# EAGLE design Nanotouch1v0 (EAGLE 5.06)
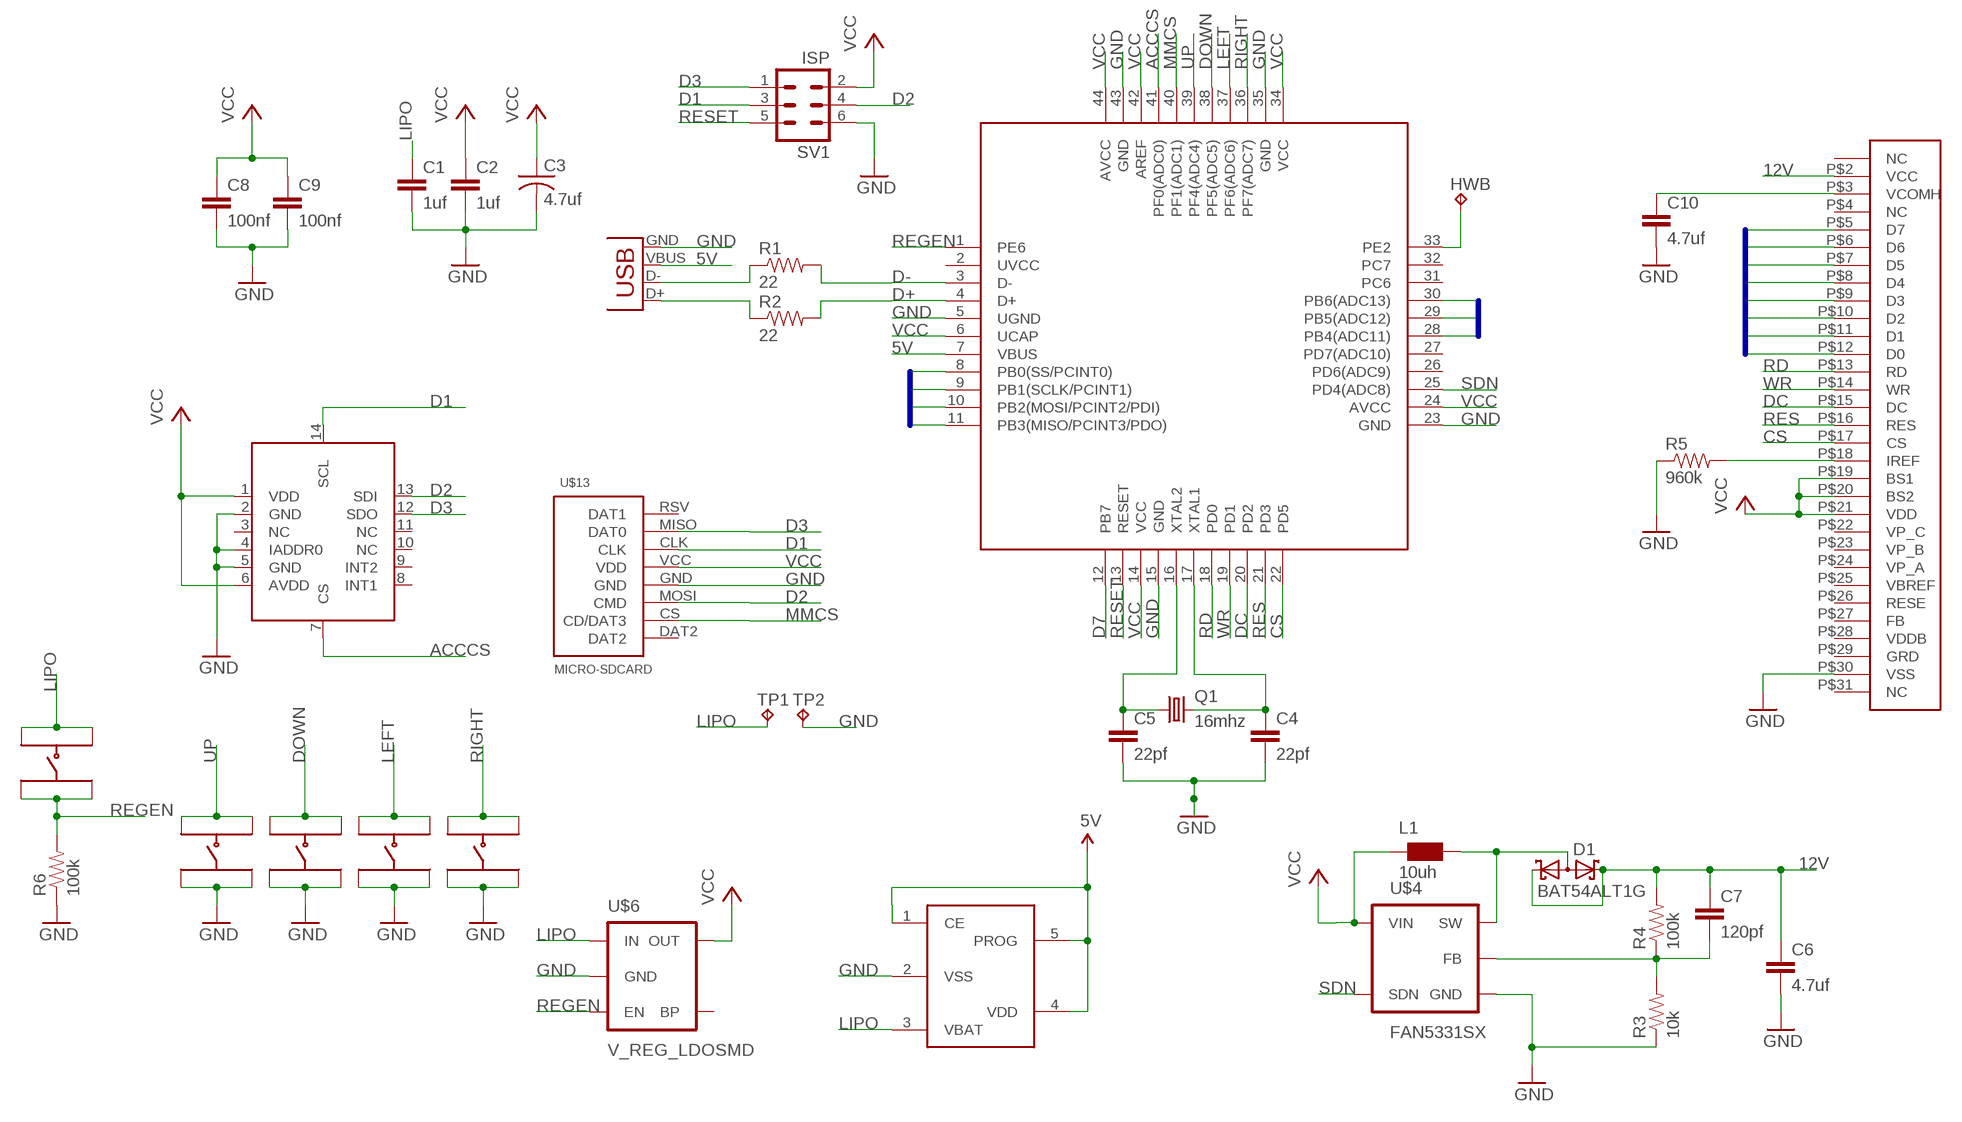
[diagram p0: schematic, sheet 1]

## Parts
C1  1uf  CAP0805  [0805]
C2  1uf  CAP0805  [0805]
C3  4.7uf  C-USC1206  [C1206]
C4  22pf  CAP0805  [0805]
C5  22pf  CAP0805  [0805]
C6  4.7uf  CAP0805  [0805]
C7  120pf  CAP0805  [0805]
C8  100nf  CAP0805  [0805]
C9  100nf  CAP0805  [0805]
C10  4.7uf  CAP0805  [0805]
D1  BAT54ALT1G  [SOT23]
HWB  TPTP10R  [TP10R]
L1  10uh  WE-KIHQ_1008  [WE-KI_1008_B]
Q1  16mhz  CRYSTAL5X3  [CRYSTAL-SMD-5X3]
R1  22  RESISTOR  [0805]
R2  22  RESISTOR  [0805]
R3  10k  RESISTOR  [0805]
R4  100k  RESISTOR  [0805]
R5  960k  RESISTOR  [0805]
R6  100k  RESISTOR  [0805]
SV1  ISP  MA03-2  [MA03-2]
TP1  TPTP10R  [TP10R]
TP2  TPTP10R  [TP10R]
U$1  ATMEGA32U4  [QFN44]
U$2  OLED104  [OLED104]
U$3  TACTSWITCH  [TACTSWITCH]
U$4  FAN5331SX  [SOT23-5]
U$5  MCP73811  [SOT23-5]
U$6  V_REG_LDOSMD  [SOT23-5]
U$7  MMA7455  [LGA]
U$9  TACTSWITCH  [TACTSWITCH]
U$10  TACTSWITCH  [TACTSWITCH]
U$11  TACTSWITCH  [TACTSWITCH]
U$12  TACTSWITCH  [TACTSWITCH]
U$13  MICRO-SDCARD  [MICRO-SDCARD]
X1  USBSMD  [USB-MINIB]

## Nets
5V [power]: U$1.7(VBUS) U$5.1(CE) U$5.4(VDD) U$5.5(PROG) X1.VBUS
12V: C6.1 C7.1 D1.1(K1) D1.2(K2) R4.2 U$2.P$2(VCC)
ACCCS: U$1.41(PF0(ADC0)) U$7.7(CS)
CS: U$1.22(PD5) U$2.P$17(CS)
D0: U$1.8(PB0(SS/PCINT0)) U$2.P$12(D0)
D1: SV1.3 U$1.9(PB1(SCLK/PCINT1)) U$2.P$11(D1) U$7.14(SCL) U$13.CLK
D2: SV1.4 U$1.10(PB2(MOSI/PCINT2/PDI)) U$2.P$10(D2) U$7.13(SDI) U$13.MOSI(CMD)
D3: SV1.1 U$1.11(PB3(MISO/PCINT3/PDO)) U$2.P$9(D3) U$7.12(SDO) U$13.MISO(DAT0)
D4: U$1.28(PB4(ADC11)) U$2.P$8(D4)
D5: U$1.29(PB5(ADC12)) U$2.P$7(D5)
D6: U$1.30(PB6(ADC13)) U$2.P$6(D6)
D7: U$1.12(PB7) U$2.P$5(D7)
D+: R2.2 U$1.4(D+)
D-: R1.2 U$1.3(D-)
DC: U$1.20(PD2) U$2.P$15(DC)
DOWN: U$1.38(PF5(ADC5)) U$9.1 U$9.4
GND [power]: C1.2 C2.2 C3.2 C4.2 C5.2 C6.2 C8.2 C9.2 C10.2 R3.1 R5.1 R6.1 SV1.6 TP2.TP U$1.5(UGND) U$1.15(GND) U$1.23(GND) U$1.35(GND) U$1.43(GND) U$2.P$30(VSS) U$3.2 U$3.3 U$4.2(GND) U$5.2(VSS) U$6.2(GND) U$7.2(GND) U$7.4(IADDR0) U$7.5(GND) U$9.2 U$9.3 U$10.2 U$10.3 U$11.2 U$11.3 U$13.GND X1.GND
LEFT: U$1.37(PF6(ADC6)) U$10.1 U$10.4
LIPO [power]: C1.1 TP1.TP U$5.3(VBAT) U$6.1(IN) U$12.1 U$12.4
MMCS: U$1.40(PF1(ADC1)) U$13.CS(CD/DAT3)
N$1: R1.1 X1.D-
N$2: R2.1 X1.D+
N$3: C4.1 Q1.3 U$1.17(XTAL1)
N$4: D1.3(AA) L1.1 U$4.1(SW)
N$5: C7.2 R3.2 R4.1 U$4.3(FB)
N$6: C5.1 Q1.1 U$1.16(XTAL2)
N$7: HWB.TP U$1.33(PE2)
N$8: R5.2 U$2.P$18(IREF)
N$9: C10.1 U$2.P$3(VCOMH)
RD: U$1.18(PD0) U$2.P$13(RD)
REGEN: R6.2 U$1.1(PE6) U$6.3(EN) U$12.2 U$12.3
RES: U$1.21(PD3) U$2.P$16(RES)
RESET: SV1.5 U$1.13(RESET)
RIGHT: U$1.36(PF7(ADC7)) U$11.1 U$11.4
SDN: U$1.25(PD4(ADC8)) U$4.5(SDN)
UP: U$1.39(PF4(ADC4)) U$3.1 U$3.4
VCC [power]: C2.1 C3.1 C8.1 C9.1 L1.2 SV1.2 U$1.6(UCAP) U$1.14(VCC) U$1.24(AVCC) U$1.34(VCC) U$1.42(AREF) U$1.44(AVCC) U$2.P$19(BS1) U$2.P$20(BS2) U$2.P$21(VDD) U$4.4(VIN) U$6.5(OUT) U$7.1(VDD) U$7.6(AVDD) U$13.VCC(VDD)
WR: U$1.19(PD1) U$2.P$14(WR)
Unconnected: U$1.2(UVCC) U$1.26(PD6(ADC9)) U$1.27(PD7(ADC10)) U$1.31(PC6) U$1.32(PC7) U$2.P$1(NC) U$2.P$4(NC) U$2.P$22(VP_C) U$2.P$23(VP_B) U$2.P$24(VP_A) U$2.P$25(VBREF) U$2.P$26(RESE) U$2.P$27(FB) U$2.P$28(VDDB) U$2.P$29(GRD) U$2.P$31(NC) U$6.4(BP) U$7.3(NC) U$7.8(INT1) U$7.9(INT2) U$7.10(NC) U$7.11(NC) U$13.DAT2 U$13.RSV(DAT1)

## Buses
D[0..7]

## Library data of the parts
C1 C2 C4-C10 = SparkFun:CAP: Capacitor Standard 0603 ceramic capacitor, and 0.1" leaded capacitor.
C3 = resistor:C-US: CAPACITOR, American symbol
D1 = PeterAtMega644:BAT54ALT1G: Schottky Dual Common Anode
HWB TP1 TP2 = testpad:TP: Test pad
L1 = PeterAtMega644:WE-KIHQ: SMD Wire Wound Ceramic Inductor WE-KIHQ - High current - Highest Quality factor in size 0805 - up to 98 - High thermal stability - High SRF -- Bluetooth -- Wireless LAN -- RF oscillation circuit -- IF impedance matching -- IG choke
Q1 = SparkFun:CRYSTAL: Crystals Various standard crystals. Proven footprints. Spark Fun Electronics SKU : COM-00534
R1-R6 = SparkFun:RESISTOR: Resistor Basic schematic elements and footprints for 0603, 1206, and PTH 1/10th watt (small) resistors.
SV1 = con-lstb:MA03-2: PIN HEADER
U$1 = PeterAtMega644:ATMEGA32U4
U$2 = PeterAtMega644:OLED104: LG 1.04 Inch OLED
U$3 U$9-U$12 = PeterAtMega644:TACTSWITCH
U$4 = PeterAtMega644:FAN5331SX: OLED Supply with 20V Integrated Switch
U$5 = PeterAtMega644:MCP73811
U$6 = PeterAtMega644:V_REG_LDO: Voltage Regulator LDO Standard 150mA LDO voltage regulator in SOT-23 layout. Micrel part MIC5205. BP (by-pass) pin is used to lower output noise with 470pF cap.
U$7 = PeterAtMega644:MMA7455
U$13 = SparkFun:MICRO-SDCARD
X1 = PeterAtMega644:USB: USB Connectors USB-B-PTH is fully proven SKU : PRT-00139 USB-miniB is fully proven SKU : PRT-00587 USB-A-PCB is untested. USB-A-H is throughly reviewed, but untested. Spark Fun Electronics SKU : PRT-00437 USB-B-SMT is throughly reviewed, but untested. Needs silkscreen touching up. USB-A-S has not been used/tested USB-MB-H has not been used/tested

## Net classes
0 default: width 0.152 mm, drill 0.406 mm, clearance 0.152 mm
1 power: width 0.152 mm, drill 0.406 mm, clearance 0.152 mm

## Board
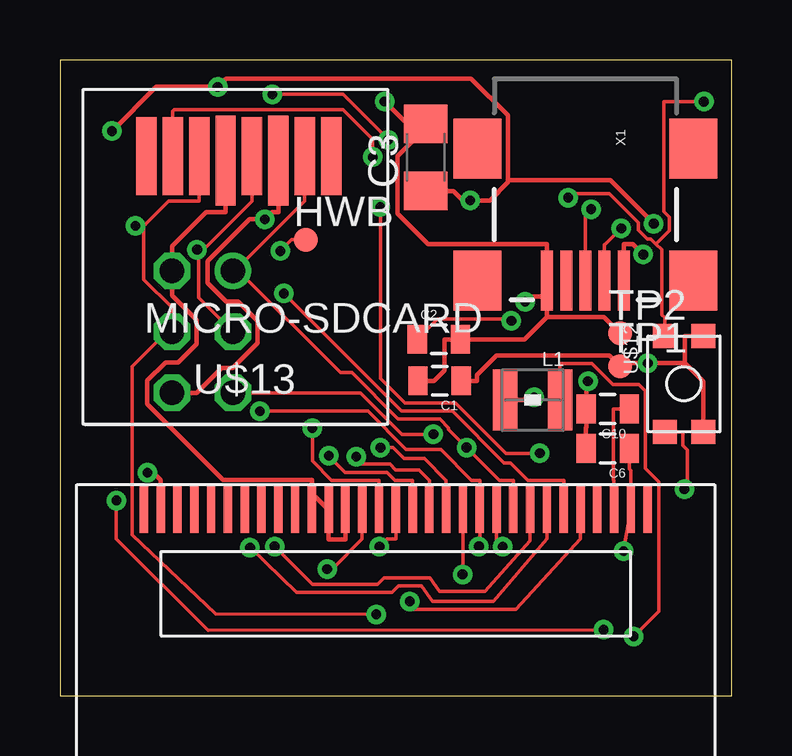
[diagram p1: board, top side]
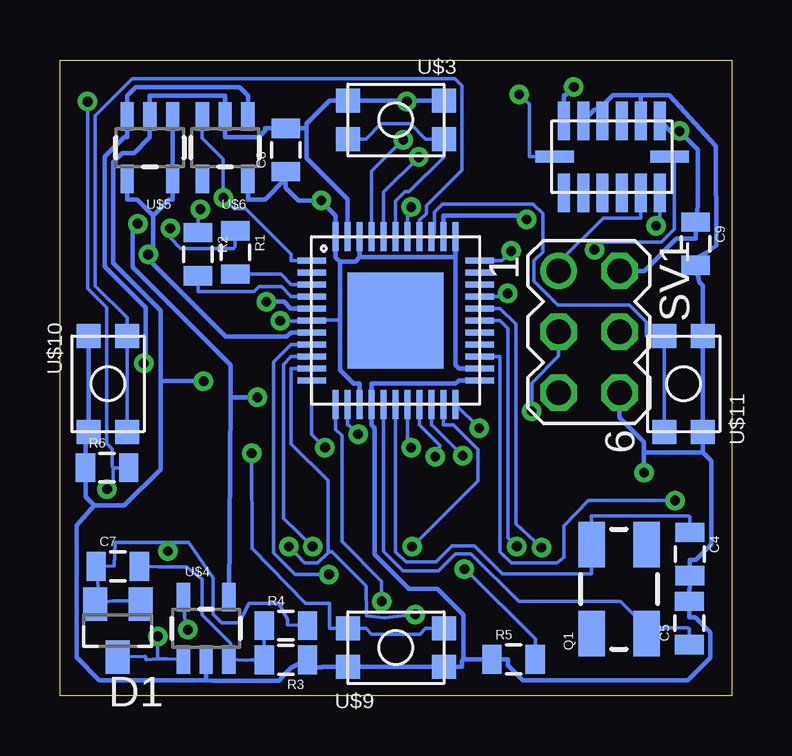
[diagram p2: board, bottom side, seen from below]

Size 28 x 26.5 mm. Coordinates in mm from the lower left corner, seen from the top.
Outline: 0,0 28,0 28,26.5 0,26.5 0,0
Copper layers (1*16): Top 0.0178mm / dielectric 1.4986mm / Bottom 0.0178mm
Design rules "SSC-EAGLE-2Lyr_v1.0.0.3": minimum track width 6mil, minimum drill 14mil, track to track 6mil, track to pad 6mil, pad to pad 6mil, via to via 6mil, smd to smd 6mil, copper to edge 20mil, drill to drill 16mil, minimum pad ring 8mil, minimum via ring 8mil, stop-mask expansion 3mil, vias tented up to drill 0mil, thermal gap 10mil

### Footprints (pad centres in the part's own frame; a part is rotated, then mirrored left to right if it is on the bottom)
0805 = smd 0.8 x 1.2: 1 -0.9,0; 2 0.9,0
C1206 = smd 1.6 x 1.8: 1 -1.4,0; 2 1.4,0
SOT23 = smd 1 x 1.4: 1 -0.95,-1.1; 2 0.95,-1.1; 3 0,1.1
TP10R = smd 1 x 1: TP 0,0
WE-KI_1008_B = smd 1.02 x 2.54: 1 -1.145,0; 2 1.145,0
CRYSTAL-SMD-5X3 = smd 1.9 x 1.1: 1 -1.85,-1.15; 2 1.85,-1.15; 3 1.85,1.15; 4 -1.85,1.15
MA03-2 = drill 1.016 round: 1 -2.54,-1.27 | drill 1.016 octagon: 2 -2.54,1.27; 3 0,-1.27; 4 0,1.27; 5 2.54,-1.27; 6 2.54,1.27
QFN44 = smd 1.2 x 0.25: 1 -3.5,2.5; 2 -3.5,2; 3 -3.5,1.5; 4 -3.5,1; 5 -3.5,0.5; 6 -3.5,0; 7 -3.5,-0.5; 8 -3.5,-1; 9 -3.5,-1.5; 10 -3.5,-2; 11 -3.5,-2.5; 23 3.5,-2.5; 24 3.5,-2; 25 3.5,-1.5; 26 3.5,-1; 27 3.5,-0.5; 28 3.5,0; 29 3.5,0.5; 30 3.5,1; 31 3.5,1.5; 32 3.5,2; 33 3.5,2.5 | smd 0.25 x 1.2: 12 -2.5,-3.5; 13 -2,-3.5; 14 -1.5,-3.5; 15 -1,-3.5; 16 -0.5,-3.5; 17 0,-3.5; 18 0.5,-3.5; 19 1,-3.5; 20 1.5,-3.5; 21 2,-3.5; 22 2.5,-3.5; 34 2.5,3.5; 35 2,3.5; 36 1.5,3.5; 37 1,3.5; 38 0.5,3.5; 39 0,3.5; 40 -0.5,3.5; 41 -1,3.5; 42 -1.5,3.5; 43 -2,3.5; 44 -2.5,3.5 | smd 4 x 4: P$45 0,0
OLED104 = smd 1.95 x 0.35: P$1 0,10.5; P$2 0,9.8; P$3 0,9.1; P$4 0,8.4; P$5 0,7.7; P$6 0,7; P$7 0,6.3; P$8 0,5.6; P$9 0,4.9; P$10 0,4.2; P$11 0,3.5; P$12 0,2.8; P$13 0,2.1; P$14 0,1.4; P$15 0,0.7; P$16 0,0; P$17 0,-0.7; P$18 0,-1.4; P$19 0,-2.1; P$20 0,-2.8; P$21 0,-3.5; P$22 0,-4.2; P$23 0,-4.9; P$24 0,-5.6; P$25 0,-6.3; P$26 0,-7; P$27 0,-7.7; P$28 0,-8.4; P$29 0,-9.1; P$30 0,-9.8; P$31 0,-10.5
TACTSWITCH = smd 1 x 1: 1 2,0.8; 2 2,-0.8; 3 -2,-0.8; 4 -2,0.8
SOT23-5 = smd 0.55 x 1.2: 1 -0.95,-1.3; 2 0,-1.3; 3 0.95,-1.3; 4 0.95,1.3; 5 -0.95,1.3
LGA = smd 1.6 x 0.5: 1 -1.5,2; 2 -1.5,1.2; 3 -1.5,0.4; 4 -1.5,-0.4; 5 -1.5,-1.2; 6 -1.5,-2; 8 1.5,-2; 9 1.5,-1.2; 10 1.5,-0.4; 11 1.5,0.4; 12 1.5,1.2; 13 1.5,2 | smd 0.5 x 1.6: 7 0,-2.4; 14 0,2.4
MICRO-SDCARD = smd 0.85 x 3.25: CLK 4.5,2.3; CS 1.2,2.3; DAT2 0.1,2.3; MISO 6.7,2.3; MOSI 2.3,2.3; RSV 7.8,2.3 | smd 0.85 x 3.75: GND 5.6,2.1; VCC 3.4,2.1
USB-MINIB = smd 2.5 x 0.5: D+ 2.5,0; D- 2.5,0.8; GND 2.5,-1.6; ID 2.5,-0.8; VBUS 2.5,1.6 | smd 2.5 x 2: GND@1 -3,-4.5; GND@2 -3,4.5; GND@3 2.5,4.5; GND@4 2.5,-4.5

### Placement (x,y rotation side)
C1  15.83,13.12 180 top
C2  15.79,14.85 0 top
C3  15.25,22.43 90 top
C4  1.74,5.9 270 bottom
C5  1.76,3.02 90 bottom
C6  22.84,10.3 180 top
C7  25.58,5.39 0 bottom
C8  18.59,22.75 90 bottom
C9  1.5,18.83 270 bottom
C10  22.84,11.94 180 top
D1  25.59,2.7 180 bottom
HWB  10.24,19 0 top
L1  19.7,12.32 180 top
Q1  4.69,4.43 90 bottom
R1  20.69,18.47 270 bottom
R2  22.25,18.4 270 bottom
R3  18.58,1.49 180 bottom
R4  18.58,2.92 0 bottom
R5  9.09,1.5 0 bottom
R6  26.04,9.5 0 bottom
SV1  5.94,15.16 270 bottom
TP1  23.35,13.73 0 top
TP2  23.35,15.1 0 top
U$1  14,15.64 0 bottom
U$2  14,7.75 270 top
U$3  14,24 180 bottom
U$4  21.91,2.8 0 bottom
U$5  24.25,22.84 180 bottom
U$6  21.11,22.85 180 bottom
U$7  4.98,22.46 270 bottom
U$9  14,2 0 bottom
U$10  26,13 270 bottom
U$11  2,13 90 bottom
U$12  26.01,13 270 top
U$13  3.51,20.19 0 top
X1  21.91,19.8 270 top

### Tracks (layer width: path | path; a pad name or v marks a point on that pad's centre or on a via)
5V  (via drill 0.41 pad 0.76)
  Top 0.178: v24.32,18.39 23.89,18.82 23.51,18.82 X1.VBUS
  Bottom 0.178: 24.11,20.01 24.11,18.56 24.28,18.39 | 24.11,20.01 24.78,20.68 25.2,20.68 U$5.4 | 24.11,20.01 23.44,20.68 23.3,20.68 U$5.5 U$5.1 | 24.28,18.39 24.28,18.15 21.09,14.96 18.55,14.96 18.37,15.14 U$1.7 | 24.28,18.39 v24.32,18.39
12V  (via drill 0.41 pad 0.76)
  Top 0.152: v23.5,6.02 U$2.P$2 23.8,9.38 23.74,9.45 C6.1
  Bottom 0.152: R4.2 18.51,2.94 18.51,3.19 18.89,3.85 20.11,3.85 20.52,3.03 21.26,3.03 21.61,3.38 21.61,4.9 22.63,6.38 23.34,6.38 | 23.34,6.38 25.7,6.38 25.73,5.41 26.39,5.39 C7.1 26.38,4.31 26.48,3.87 | 23.34,6.38 v23.5,6.02 | 26.48,3.87 D1.2 | 26.48,3.87 25.79,3.94 24.73,3.96 D1.1
ACCCS  (via drill 0.41 pad 0.76)
  Top 0.152: v8.85,25.07 11.8,25.07 v13.69,23.18
  Bottom 0.152: U$1.41 15,21.87 v13.69,23.18 | U$7.7 8.44,22.46 8.44,24.65 v8.85,25.07
CS  (via drill 0.41 pad 0.76)
  Top 0.152: U$2.P$17 13.3,8.98 11.33,8.98 10.53,9.78 v10.53,11.15
  Bottom 0.152: U$1.22 10.53,11.17 v10.53,11.15
D0  (via drill 0.41 pad 0.76)
  Top 0.152: v16.78,5.05 16.8,5.22 16.8,6.52 U$2.P$12
  Bottom 0.152: v16.78,5.05 18.2,5.05 19.09,5.95 19.09,13.9 18.35,14.64 U$1.8
D1  (via drill 0.41 pad 0.76)
  Top 0.152: v8.33,11.86 12.84,11.86 14.43,10.26 15.88,10.26 17.16,8.98 17.5,8.98 U$2.P$11 17.5,6.52 17.5,6.23 v17.47,6.21 | 5.85,18.46 v5.72,18.59 | 5.85,18.46 5.78,18.38 5.78,16.6 SV1.3 | 5.85,18.46 8.01,20.61 U$13.CLK
  Bottom 0.152: v8.33,11.86 8.33,13.03 7.21,14.15 SV1.3 | v17.47,6.21 18.68,7.38 18.68,13.81 18.35,14.14 U$1.9 | U$7.14 2.39,22.27 2.39,19.44 2.93,18.9 5.4,18.9 v5.72,18.59
D2  (via drill 0.41 pad 0.76)
  Top 0.152: v13.19,3.38 6.48,3.41 3.01,6.71 3.01,13.71 4.67,15.38 | 4.67,15.38 4.67,15.59 4.67,15.67 4.67,16.18 3.5,17.35 3.5,19.58 | 4.67,15.38 SV1.4 | v18.46,6.21 18.2,6.47 18.2,6.52 U$2.P$10 | 3.5,19.58 4.53,20.61 5.8,20.61 U$13.MOSI | 3.5,19.58 v3.15,19.58
  Bottom 0.152: v13.19,3.38 14.47,3.23 15.22,3.32 15.24,4.57 16.68,6.01 16.82,5.96 | 16.82,5.96 16.82,8.96 18.35,10.49 18.35,13.64 U$1.10 | v18.46,6.21 17.8,5.53 17.25,5.53 16.82,5.96 | U$7.13 2.98,19.91 3.15,19.74 v3.15,19.58
D3  (via drill 0.41 pad 0.76)
  Top 0.152: 7.37,17.78 11.7,13.46 12.17,13.46 14.1,11.53 15.84,11.53 16.21,11.16 16.21,11.09 v16.95,10.34 18.32,8.98 18.9,8.98 U$2.P$9 | 7.37,17.78 10.21,20.61 U$13.MISO | SV1.1 7.29,17.7 7.37,17.78
  Bottom 0.152: U$1.11 17.5,10.89 v16.95,10.34 | SV1.1 7.21,18.05 5.35,19.91 3.78,19.91 U$7.12
D4  (via drill 0.41 pad 0.76)
  Top 0.152: U$2.P$8 19.6,6.46 17.71,4.33 15.83,4.33 15.43,4.92 13.52,4.92 13.24,4.63 10.53,4.63 v8.95,6.21
  Bottom 0.152: v8.95,6.21 9.32,6.58 9.32,15.31 9.65,15.64 U$1.28
D5  (via drill 0.41 pad 0.76)
  Top 0.152: v7.93,6.17 9.87,4.3 13.84,4.3 14.11,4.57 15.07,4.57 15.54,3.93 18.06,3.93 20.3,6.52 U$2.P$7
  Bottom 0.152: U$1.29 9.65,16.14 8.98,15.48 8.98,7.15 v7.93,6.17
D6  (via drill 0.41 pad 0.76)
  Top 0.152: v9.34,16.77 14.24,11.86 16.36,11.86 18.52,9.7 18.78,9.7 19.5,8.98 21,8.98 U$2.P$6
  Bottom 0.152: v9.34,16.77 9.52,16.77 9.65,16.64 U$1.30
D7  (via drill 0.41 pad 0.76)
  Top 0.152: v14.59,3.92 14.63,3.6 19.01,3.6 21.7,6.52 U$2.P$5
  Bottom 0.152: U$1.12 16.5,11.1 16.25,10.85 16.25,6.42 14.59,4.76 v14.59,3.92
D+
  Bottom 0.152: R2.2 22.25,16.85 19.91,16.85 19.7,17.05 18.77,17.05 18.35,16.64 U$1.4
D-
  Bottom 0.152: U$1.3 18.35,17.14 18.79,17.57 19.84,17.57 R1.2
DC  (via drill 0.41 pad 0.76)
  Top 0.152: v11.21,10 11.89,9.31 13.63,9.31 13.96,8.98 14.7,8.98 U$2.P$15
  Bottom 0.152: v11.21,10 12.49,11.29 12.5,11.29 U$1.20
DOWN  (via drill 0.41 pad 0.76)
  Top 0.152: v20.01,10.1 18.59,10.1 16.5,12.19 14.38,12.19 13.36,13.21 v13.36,20.37
  Bottom 0.152: U$9.1 12.75,2.8 12.99,2.56 15.01,2.56 15.25,2.8 U$9.4 16.38,2.8 16.75,2.8 16.75,3.23 16.75,3.83 17.75,3.83 19.98,6.14 v20.01,10.1 | v13.36,20.37 13.5,20.22 U$1.38
GND  (via drill 0.41 pad 0.76)
  Top 0.178: v3.65,9.29 3.9,9.29 4.2,8.99 U$2.P$30 | 14.95,23.36 14.08,22.48 14.08,20.09 15.35,18.82 20.31,18.82 X1.GND 20.31,16.63 | SV1.6 5.7,12.62 6.73,13.66 7.2,13.66 8.24,14.69 8.24,15.61 7.42,16.43 6.93,16.43 6.16,17.2 6.16,18.11 7.9,19.86 v8.54,19.86 8.84,20.15 9.11,20.15 U$13.GND | C1.2 15.6,13.12 16.03,13.55 16.03,14.85 C2.2 17.36,14.85 19.37,14.85 20.31,15.78 | 20.31,16.63 19.61,16.63 v19.39,16.42 | 20.31,16.63 20.31,15.78 | v22.01,13.11 22.01,12.89 21.94,12.81 C10.2 21.94,11.17 C6.2 | 14.95,23.36 15.25,23.65 C3.2 | v13.53,24.77 14.95,23.36 | TP2.TP 22.67,15.78 20.31,15.78
  Bottom 0.178: 17.72,23.65 17.72,22.41 16,20.7 U$1.43 | 17.72,23.65 17.81,23.65 C8.2 19.45,23.65 19.45,23.55 19.73,23.28 21.11,23.28 U$6.2 21.11,25.01 24.25,25.01 U$5.2 24.25,23.28 24.91,22.62 25.4,22.62 25.79,22.23 25.79,18.03 23.81,16.05 23.81,13.11 | 17.72,23.65 17.72,23.85 16.77,24.8 U$3.2 15.62,24.8 15.23,24.8 13.53,24.8 | 21.91,0.64 21.66,0.62 18.86,0.62 18.63,0.89 18.37,1.16 R3.1 17.58,1.19 17.51,1.19 17.41,1.19 17.08,1.19 17.06,1.2 16.77,1.2 16.38,1.2 U$9.3 15.23,1.2 12.77,1.2 12.38,1.2 U$9.2 11.23,1.2 11.23,1.46 11.19,1.5 | 26.58,7.92 25.32,7.92 23.81,9.44 23.81,13.11 | 26.58,7.92 26.93,8.28 26.93,8.63 R6.1 26.93,11.14 26.8,11.27 | 26.58,7.92 27.31,7.09 27.31,1.59 26.36,0.64 21.91,0.64 | 21.91,0.64 U$4.2 | 11.19,1.5 11.19,3.36 12.26,4.44 13.46,4.44 14.89,5.88 14.89,11.16 15,11.28 U$1.15 15,13.01 11.5,13.01 11.37,13.14 U$1.23 | 11.19,1.5 10.65,1.5 R5.1 9.32,1.5 9.32,1.25 8.7,0.64 1.83,0.64 0.9,1.57 0.9,2.64 1.51,3.25 1.76,3.25 C5.2 1.76,4.26 1.76,4.44 1.74,4.46 C4.2 1.74,5.67 1.49,5.67 0.85,6.3 0.85,9.79 1.2,10.14 | 3.65,10.14 v3.65,9.29 | 1.2,10.14 1.2,10.23 U$11.3 1.2,11.77 1.2,14.23 1.2,14.62 U$11.2 1.2,17.1 1.35,17.24 C9.2 1.5,18.22 1.07,18.45 0.63,18.76 0.66,22.91 2.6,25.03 3.78,25.03 | 1.2,10.14 3.65,10.14 | 3.65,10.14 3.65,10.57 4.67,11.6 SV1.6 | v19.39,16.42 18.66,16.42 18.38,16.14 U$1.5 | U$1.35 12,20.01 8.7,20.01 v8.54,19.86 | 5.38,24.43 5.38,24.6 4.95,25.03 3.78,25.03 | 5.38,24.43 5.71,24.43 U$7.5 | 3.78,25.03 U$7.2 | 23.81,13.11 v22.01,13.11 | 13.53,24.8 12.77,24.8 U$3.3 | 13.53,24.8 v13.53,24.77 | 26.8,11.27 26.8,11.77 26.8,14.62 U$10.3
  Bottom 0.178: 26.8,11.27 U$10.2 | 5.38,24.43 U$7.4
LEFT
  Bottom 0.152: U$1.37 13,19.82 12.72,20.1 12.72,20.43 11.25,21.9 11.25,25.43 11.52,25.71 24.99,25.71 26.53,24.17 26.53,17.08 25.2,15.75 U$10.4 U$10.1
LIPO  (via drill 0.41 pad 0.76)
  Top 0.178: C1.1 17.39,13.12 17.39,13.37 18.21,14.18 22.9,14.18 TP1.TP 23.47,13.86 v24.51,13.86 26.05,13.86 | 26.05,13.86 26.81,13.09 26.81,11.77 U$12.1 | 26.05,13.86 26.05,15 U$12.4
  Bottom 0.178: v24.51,13.86 24.43,13.93 24.43,16.17 26.14,17.88 26.14,22.46 25.33,23.28 25.2,23.28 U$5.3 25.2,25.01 24.84,25.37 20.52,25.37 20.16,25.01 U$6.1
MMCS  (via drill 0.41 pad 0.76)
  Top 0.152: v13.04,22.45 13.04,23.19 11.81,24.42 4.75,24.42 4.71,24.37 U$13.CS
  Bottom 0.152: U$1.40 14.5,20.99 v13.04,22.45
N$1  (via drill 0.41 pad 0.76)
  Top 0.152: X1.D- 22.71,18.8 22.73,18.8 v23.41,19.48
  Bottom 0.152: R1.1 20.69,18.72 20.76,18.64 22.97,18.64 23.41,19.08 v23.41,19.48
N$2  (via drill 0.41 pad 0.76)
  Top 0.152: X1.D+ 21.91,20.04 v22.15,20.28
  Bottom 0.152: R2.1 22.25,19.96 22.15,20.05 v22.15,20.28
N$3
  Bottom 0.152: U$1.17 14,11.29 14,5.98 13.58,5.57 12.32,5.57 11.65,6.24 10.72,6.24 9.56,5.08 5.84,5.08 Q1.3 5.84,7.49 1.78,7.49 1.74,7.45 C4.1
N$4  (via drill 0.41 pad 0.76)
  Top 0.152: v23.92,2.47 24.97,3.52 24.97,8.9 24.4,9.47 24.4,12.7 24.14,12.96 23.06,12.96 22.18,13.84 20.85,13.84 L1.1
  Bottom 0.152: 23.92,1.52 24.41,1.5 24.45,1.63 D1.3 | U$4.1 23.56,1.52 23.92,1.52 | 23.92,1.52 v23.92,2.47
N$5
  Bottom 0.152: C7.2 23.88,5.37 22.72,5.37 22.07,4.84 22.07,3.37 20.88,2.18 U$4.3 20.22,1.48 20.03,1.49 R3.2 R4.1
N$6
  Bottom 0.152: 3.54,2.83 4.63,3.92 8.87,3.92 10.86,5.91 11.52,5.91 12.22,5.2 13.69,5.2 14.5,6.02 14.5,11.29 U$1.16 | C5.1 1.76,2.78 1.82,2.83 3.54,2.83 | 3.54,2.83 Q1.1
N$7  (via drill 0.41 pad 0.76)
  Top 0.152: HWB.TP 9.66,19 v9.19,18.54
  Bottom 0.152: v9.19,18.54 9.58,18.14 9.65,18.14 U$1.33
N$8  (via drill 0.41 pad 0.76)
  Top 0.152: v11.14,5.27 11.35,5.27 12.6,6.52 U$2.P$18
  Bottom 0.152: v11.14,5.27 11.1,5.27 8.19,2.36 R5.2
N$9
  Top 0.152: C10.1 23.09,11.94 23.08,11.94 23.08,9 23.1,8.98 U$2.P$3
RD  (via drill 0.41 pad 0.76)
  Top 0.152: v13.36,10.34 13.89,10.34 14.34,9.89 15.19,9.89 16.1,8.98 U$2.P$13
  Bottom 0.152: U$1.18 13.5,10.47 v13.36,10.34
REGEN  (via drill 0.41, 0.41 pad 0.76)
  Top 0.152: v21.19,20.76 21.35,20.92 22.92,20.92 24.12,19.71 24.12,19.41 24.49,19.04 24.64,19.04 24.85,18.83 | 24.85,18.83 25.09,18.59 25.09,15.87 25.21,15.75 U$12.3 | v26.03,8.6 26.16,8.72 26.16,10.25 25.97,10.43 25.97,11 U$12.2 | v26.85,24.77 25.17,24.77 25.17,20.17 25.4,19.94 25.4,19.38 24.89,18.87 24.85,18.83
  Bottom 0.152: R6.2 25.79,9.5 | v26.03,8.6 25.79,8.85 25.79,9.5 | U$6.3 22.07,23.24 21.19,22.36 v21.19,20.76 20.73,20.3 20.25,20.3 18.35,18.4 18.35,18.14 U$1.1 | v26.85,24.77 26.85,16.97 26.06,16.18 26.06,10.52 25.83,10.29 25.83,9.55 25.79,9.5
RES  (via drill 0.41 pad 0.76)
  Top 0.152: v13.32,6.21 13.63,6.52 14,6.52 U$2.P$16
  Bottom 0.152: v13.32,6.21 10.57,8.96 10.57,10.27 11.59,11.29 12,11.29 U$1.21
RESET  (via drill 0.41 pad 0.76)
  Top 0.152: v15.57,10.9 14.27,10.9 12.54,12.62 SV1.5
  Bottom 0.152: U$1.13 16,11.29 15.96,11.29 v15.57,10.9
RIGHT
  Bottom 0.152: U$1.36 12.39,19.25 12.39,20.16 12.05,20.5 8.28,20.5 7.87,20.09 7.87,18.49 8.23,18.13 8.23,17.28 7.23,16.28 4.27,16.28 3.55,15.57 3.55,15 U$11.1 2.8,14.75 2.8,14.29 2.8,11.57 2.8,11.38 U$11.4
SDN  (via drill 0.41 pad 0.76)
  Top 0.152: v22.66,2.74 6.17,2.72 2.35,6.54 v2.35,8.13
  Bottom 0.152: U$4.5 22.78,3.07 22.66,2.95 v22.66,2.74 | U$1.25 9.65,14.14 9.65,5.98 9.19,5.52 7.27,5.52 6.99,5.76 6.99,7.07 5.98,8.13 v2.35,8.13
UP
  Bottom 0.152: U$1.39 14,20 14,20.62 13.62,21 13.45,21 12,22.45 U$3.4 12.75,23.2 13.39,23.83 14.61,23.83 15.25,23.2 U$3.1
VCC  (via drill 0.41, 0.41 pad 0.76)
  Top 0.152: v18.82,15.62 18.82,15.7 15.75,15.7 14.91,14.86 C2.1
  Top 0.178: v19.77,12.43 19.45,12.43 19.33,12.31 L1.2 | U$2.P$19 11.9,6.51 11.2,6.51 U$2.P$20 10.58,8.37 10.5,8.37 | 10.5,8.37 10.5,8.99 6.79,8.99 3.64,12.15 3.64,13.12 4.41,13.89 4.93,13.89 5.7,14.66 5.7,15.65 4.67,16.68 SV1.2 4.67,18.73 6.09,20.15 6.91,20.15 U$13.VCC | 10.5,8.37 U$2.P$21 | 18.67,21.49 18.67,21.4 17.92,20.65 v17.11,20.65 16.8,20.65 16.42,21.03 C3.1 | 18.67,21.49 18.67,24.2 17.15,25.72 6.92,25.72 v6.58,25.38 4.01,25.38 v2.17,23.53 | 18.67,21.49 22.94,21.49 v24.76,19.67
  Bottom 0.152: v18.82,15.62 17.5,15.62 U$1.6 17.42,15.65 16.41,15.65 16.33,15.65
  Bottom 0.178: 11.5,18.27 11.5,13.78 11.37,13.64 U$1.24 | 15.5,18.27 11.5,18.27 | 11.5,18.27 U$1.34 | 15.5,18.27 15.5,18.36 U$1.42 | 16.33,18.09 15.68,18.09 15.5,18.27 | 16.33,18.09 16.5,18.27 U$1.44 16.5,20.01 17.11,20.61 v17.11,20.65 18.05,20.65 18.59,21.18 18.59,21.55 | 16.33,18.09 16.33,15.65 16.33,13.57 15.76,13.01 15.5,13.01 U$1.14 | 20.88,12.43 v19.77,12.43 | 20.88,12.43 U$4.4 | v24.76,19.67 24.97,19.46 24.97,17.87 20.88,13.78 20.88,12.43 | U$6.5 20.16,20.68 19.45,20.68 18.59,21.55 | 18.59,21.55 C8.1 | U$7.1 2.55,23.53 v2.17,23.53 1.4,22.76 1.4,20.43 C9.1 1.5,19.04 2.3,19.04 3.64,17.7 4.16,17.7 4.5,17.7 SV1.2 | v6.58,25.38 6.92,25.03 6.98,25.03 U$7.6
WR  (via drill 0.41 pad 0.76)
  Top 0.152: v12.35,9.96 12.45,9.65 13.76,9.65 13.99,9.42 14.96,9.42 15.4,8.98 U$2.P$14
  Bottom 0.152: v12.35,9.96 12.15,10.43 13,11.29 U$1.19